# EAGLE schematic PinguinoBase (EAGLE 6.5.0)
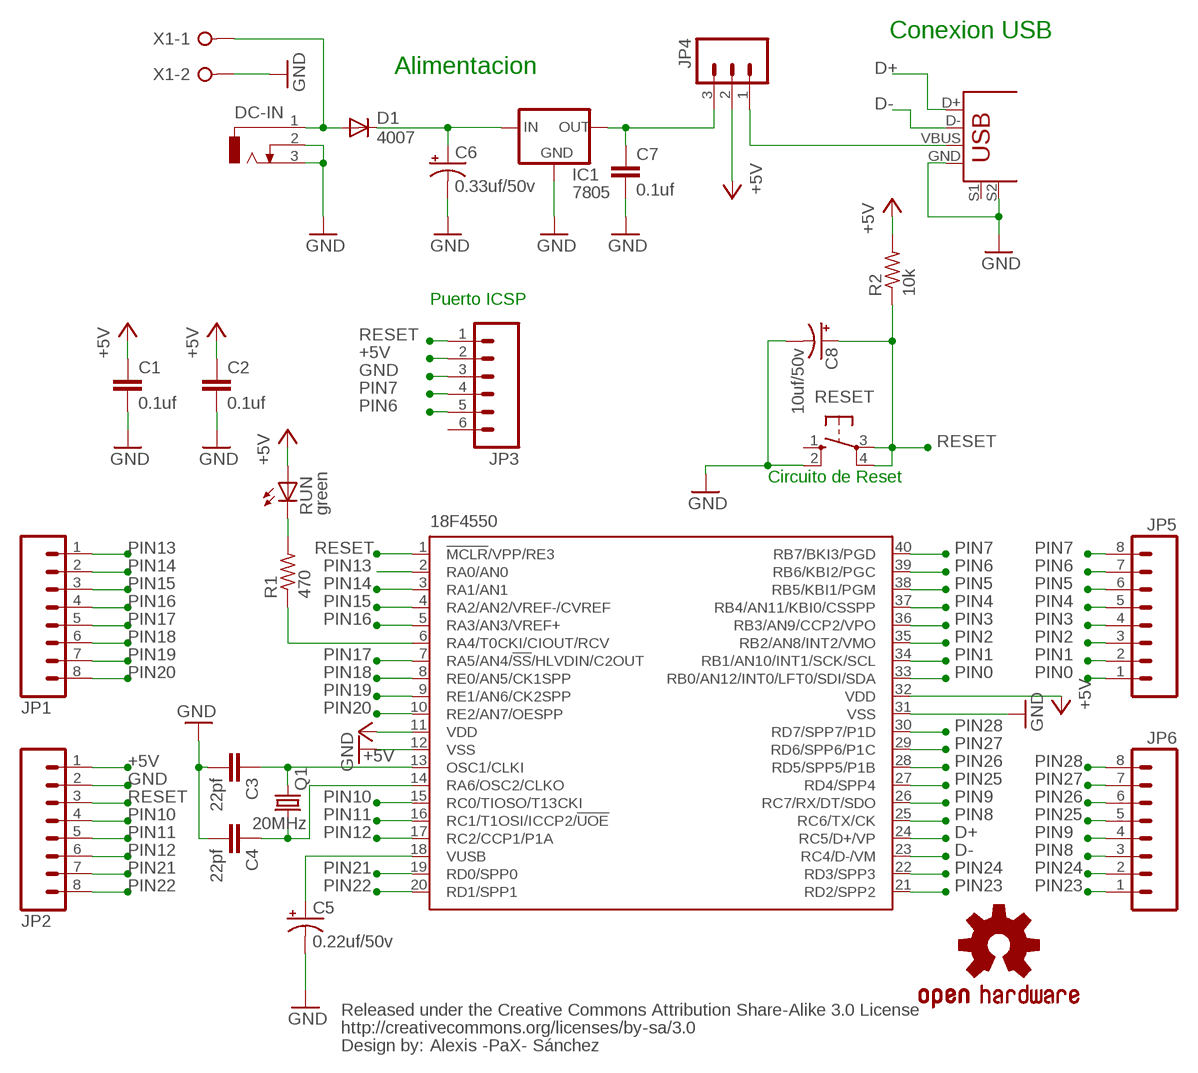
[diagram p0: schematic, sheet 1]

## Parts
18F4550  PIC18F4550_40  [DIL40]
C1  0.1uf  CAPPTH2  [CAP-PTH-SMALL2]
C2  0.1uf  CAPPTH2  [CAP-PTH-SMALL2]
C3  22pf  CAPPTH2  [CAP-PTH-SMALL2]
C4  22pf  CAPPTH2  [CAP-PTH-SMALL2]
C5  0.22uf/50v  CAP_POLPTH2  [CPOL-RADIAL-10UF-25V]
C6  0.33uf/50v  CAP_POLPTH2  [CPOL-RADIAL-10UF-25V]
C7  0.1uf  CAPPTH2  [CAP-PTH-SMALL2]
C8  10uf/50v  CAP_POLPTH2  [CPOL-RADIAL-10UF-25V]
CC_TEXT1  CREATIVE_COMMONS  [CREATIVE_COMMONS]
D1  4007  1N4148DO35-7  [DO35-7]
DC-IN  DCJ0303  [DCJ0303]
IC1  7805  78XXL  [78XXL]
JP1  M08LONGPADS  [1X08_LONGPADS]
JP2  M08LONGPADS  [1X08_LONGPADS]
JP3  M06LONGPADS  [1X06_LONGPADS]
JP4  M03LONGPADS  [1X03_LONGPADS]
JP5  M08LONGPADS  [1X08_LONGPADS]
JP6  M08LONGPADS  [1X08_LONGPADS]
LOGO2  OSHW-LOGOL  [OSHW-LOGO-L]
Q1  20MHz  CRYSTALHC49U-V  [HC49U-V]
R1  470  R-US_0207/7  [0207/7]
R2  10k  R-US_0207/7  [0207/7]
RESET  10-XX  [B3F-10XX]
RUN  green  LED3MM  [LED3MM]
USB  USB+SHIELD  [USB-B-PTH]
X1  W237-02P  [W237-132]

## Nets
+5V: 18F4550.11(VDD) 18F4550.32(VDD) C1.1 C2.1 JP2.1 JP3.2 JP4.2 R2.2 RUN.A
D+: 18F4550.24(RC5/D+/VP) USB.D+
D-: 18F4550.23(RC4/D-/VM) USB.D-
GND: 18F4550.12(VSS) 18F4550.31(VSS) C1.2 C2.2 C3.2 C4.2 C5.2(-) C6.2(-) C7.2 C8.2(-) DC-IN.2 DC-IN.3 IC1.GND JP2.2 JP3.3 RESET.2(S1) USB.GND USB.S2 X1.2
N$1: 18F4550.13(OSC1/CLKI) C3.1 Q1.1
N$2: C6.1(+) D1.C IC1.IN
N$3: C7.1 IC1.OUT JP4.3
N$4: JP4.1 USB.VBUS
N$5: 18F4550.14(RA6/OSC2/CLKO) C4.1 Q1.2
N$6: 18F4550.18(VUSB) C5.1(+)
N$7: R1.2 RUN.K(C)
N$8: 18F4550.6(RA4/T0CKI/CIOUT/RCV) R1.1
N$11: D1.A DC-IN.1 X1.1
PIN0: 18F4550.33(RB0/AN12/INT0/LFT0/SDI/SDA) JP5.1
PIN1: 18F4550.34(RB1/AN10/INT1/SCK/SCL) JP5.2
PIN2: 18F4550.35(RB2/AN8/INT2/VMO) JP5.3
PIN3: 18F4550.36(RB3/AN9/CCP2/VPO) JP5.4
PIN4: 18F4550.37(RB4/AN11/KBI0/CSSPP) JP5.5
PIN5: 18F4550.38(RB5/KBI1/PGM) JP5.6
PIN6: 18F4550.39(RB6/KBI2/PGC) JP3.5 JP5.7
PIN7: 18F4550.40(RB7/BKI3/PGD) JP3.4 JP5.8
PIN8: 18F4550.25(RC6/TX/CK) JP6.3
PIN9: 18F4550.26(RC7/RX/DT/SDO) JP6.4
PIN10: 18F4550.15(RC0/TIOSO/T13CKI) JP2.4
PIN11: 18F4550.16(RC1/T1OSI/ICCP2/!UOE) JP2.5
PIN12: 18F4550.17(RC2/CCP1/P1A) JP2.6
PIN13: 18F4550.2(RA0/AN0) JP1.1
PIN14: 18F4550.3(RA1/AN1) JP1.2
PIN15: 18F4550.4(RA2/AN2/VREF-/CVREF) JP1.3
PIN16: 18F4550.5(RA3/AN3/VREF+) JP1.4
PIN17: 18F4550.7(RA5/AN4/!SS!/HLVDIN/C2OUT) JP1.5
PIN18: 18F4550.8(RE0/AN5/CK1SPP) JP1.6
PIN19: 18F4550.9(RE1/AN6/CK2SPP) JP1.7
PIN20: 18F4550.10(RE2/AN7/OESPP) JP1.8
PIN21: 18F4550.19(RD0/SPP0) JP2.7
PIN22: 18F4550.20(RD1/SPP1) JP2.8
PIN23: 18F4550.21(RD2/SPP2) JP6.1
PIN24: 18F4550.22(RD3/SPP3) JP6.2
PIN25: 18F4550.27(RD4/SPP4) JP6.5
PIN26: 18F4550.28(RD5/SPP5/P1B) JP6.6
PIN27: 18F4550.29(RD6/SPP6/P1C) JP6.7
PIN28: 18F4550.30(RD7/SPP7/P1D) JP6.8
RESET: 18F4550.1(!MCLR!/VPP/RE3) C8.1(+) JP2.3 JP3.1 R2.1 RESET.3(P) RESET.4(P1)
Unconnected: JP3.6 RESET.1(S) USB.S1

## Notes on the sheet
- Conexion USB
- Alimentacion
- Puerto ICSP
- Circuito de Reset
- Alexis -PaX- Sánchez

## Library data of the parts
18F4550 = microchip:PIC18F4*_40: USB Microcontrollers with nanoWatt Technology High-Performance, Enhanced Flash, 28/40/44-Pin, Source: http://ww1.microchip.com/downloads/en/devicedoc/39632c.pdf; DIGIKEY: PIC18F4550-I/P-ND; MF: MICROCHIP; MPN: PIC18F4550-I/P; OC_FARNELL: 9321357; OC_NEWARK: 74K8623
C1-C4 C7 = SparkFun:CAP: Capacitor Standard 0603 ceramic capacitor, and 0.1" leaded capacitor.
C5 C6 C8 = SparkFun:CAP_POL: Capacitor Polarized These are standard SMD and PTH capacitors. Normally 10uF, 47uF, and 100uF in electrolytic and tantalum varieties. Always verify the external diameter of the through hole cap, it varies with capacity, voltage, and manufacturer. The EIA devices should be standard.
CC_TEXT1 = SparkFun-Aesthetics:CREATIVE_COMMONS: Creative Commons License summary
D1 = diode:1N4148: DIODE high speed (Philips)
DC-IN = jack:DCJ0303: DC POWER JACK Source: DCJ0303.pdf; OC_FARNELL: unknown; OC_NEWARK: unknown
IC1 = v-reg:78XXL: VOLTAGE REGULATOR
JP1 JP2 JP5 JP6 = SparkFun:M08: Header 8 Standard 8-pin 0.1" header. Use with straight break away headers (SKU : PRT-00116), right angle break away headers (PRT-00553), swiss pins (PRT-00743), machine pins (PRT-00117), and female headers (PRT-00115).
JP3 = SparkFun:M06: Header 6 Standard 6-pin 0.1" header. Use with straight break away headers (SKU : PRT-00116), right angle break away headers (PRT-00553), swiss pins (PRT-00743), machine pins (PRT-00117), and female headers (PRT-00115). Molex polarized connector foot print use with SKU : PRT-08094 with associated crimp pins and housings. NOTES ON THE VARIANTS LOCK and LOCK_LONGPADS... This footprint was designed to help hold the alignment of a through-hole component (i.e. 6-pin header) while soldering it into place. You may notice that each hole has been shifted either up or down by 0.005 of an inch from it's more standard position (which is a perfectly straight line). This slight alteration caused the pins (the squares in the middle) to touch the edges of the holes. Because they are alternating, it causes a "brace" to hold the component in place. 0.005 has proven to be the perfect amount of "off-center" position when using our standard breakaway headers. Although looks a little odd when you look at the bare footprint, once you have a header in there, the alteration is very hard to notice. Also, if you push a header all the way into place, it is covered up entirely on the bottom side. This idea of altering the position of holes to aid alignment will be further integrated into the Sparkfun Library for other footprints. It can help hold any component with 3 or more connection pins.
JP4 = SparkFun:M03: Header 3 Standard 3-pin 0.1" header. Use with straight break away headers (SKU : PRT-00116), right angle break away headers (PRT-00553), swiss pins (PRT-00743), machine pins (PRT-00117), and female headers (PRT-00115). Molex polarized connector foot print use with SKU : PRT-08232 with associated crimp pins and housings.
LOGO2 = SparkFun-Aesthetics:OSHW-LOGO: Open Source Hardware Logo This logo indicates the piece of hardware it is found on incorporates a OSHW license and/or adheres to the definition of open source hardware found here: http://freedomdefined.org/OSHW
Q1 = crystal:CRYSTAL: CRYSTAL; OC_FARNELL: 1666969; OC_NEWARK: unknown
R1 R2 = resistor:R-US_: RESISTOR, American symbol
RESET = switch-omron:10-XX: OMRON SWITCH; MPN: B3F-1000; OC_FARNELL: 176432; OC_NEWARK: 36M3542
RUN = led:LED: LED OSRAM: - CHIPLED LG R971, LG N971, LY N971, LG Q971, LY Q971, LO R971, LY R971 LH N974, LH R974 LS Q976, LO Q976, LY Q976 LO Q996 - Hyper CHIPLED LW Q18S LB Q993, LB Q99A, LB R99A - SideLED LS A670, LO A670, LY A670, LG A670, LP A670 LB A673, LV A673, LT A673, LW A673 LH A674 LY A675 LS A676, LA A676, LO A676, LY A676, LW A676 LS A679, LY A679, LG A679 - Hyper Micro SIDELED® LS Y876, LA Y876, LO Y876, LY Y876 LT Y87S - SmartLED LW L88C, LW L88S LB L89C, LB L89S, LG L890 LS L89K, LO L89K, LY L89K LS L896, LA L896, LO L896, LY L896 - TOPLED LS T670, LO T670, LY T670, LG T670, LP T670 LSG T670, LSP T670, LSY T670, LOP T670, LYG T670 LG T671, LOG T671, LSG T671 LB T673, LV T673, LT T673, LW T673 LH T674 LS T676, LA T676, LO T676, LY T676, LB T676, LH T676, LSB T676, LW T676 LB T67C, LV T67C, LT T67C, LS T67K, LO T67K, LY T67K, LW E67C LS E67B, LA E67B, LO E67B, LY E67B, LB E67C, LV E67C, LT E67C LW T67C LS T679, LY T679, LG T679 LS T770, LO T770, LY T770, LG T770, LP T770 LB T773, LV T773, LT T773, LW T773 LH T774 LS E675, LA E675, LY E675, LS T675 LS T776, LA T776, LO T776, LY T776, LB T776 LHGB T686 LT T68C, LB T68C - Hyper Mini TOPLED® LB M676 - Mini TOPLED Santana® LG M470 LS M47K, LO M47K, LY M47K Source: http://www.osram.convergy.de LUXEON: - LUMILED® LXK2-PW12-R00, LXK2-PW12-S00, LXK2-PW14-U00, LXK2-PW14-V00 LXK2-PM12-R00, LXK2-PM12-S00, LXK2-PM14-U00 LXK2-PE12-Q00, LXK2-PE12-R00, LXK2-PE12-S00, LXK2-PE14-T00, LXK2-PE14-U00 LXK2-PB12-K00, LXK2-PB12-L00, LXK2-PB12-M00, LXK2-PB14-N00, LXK2-PB14-P00, LXK2-PB14-Q00 LXK2-PR12-L00, LXK2-PR12-M00, LXK2-PR14-Q00, LXK2-PR14-R00 LXK2-PD12-Q00, LXK2-PD12-R00, LXK2-PD12-S00 LXK2-PH12-R00, LXK2-PH12-S00 LXK2-PL12-P00, LXK2-PL12-Q00, LXK2-PL12-R00 Source: www.luxeon.com KINGBRIGHT: KA-3528ASYC Source: www.kingbright.com
USB = SparkFun:USB+SHIELD: USB+Shield USB connector with shield pins connectable
X1 = con-wago-508:W237-02P: WAGO SREW CLAMP; OC_FARNELL: unknown; OC_NEWARK: unknown